# Altium schematic sheet Expansion & Miscelaneous.SchDoc
size A
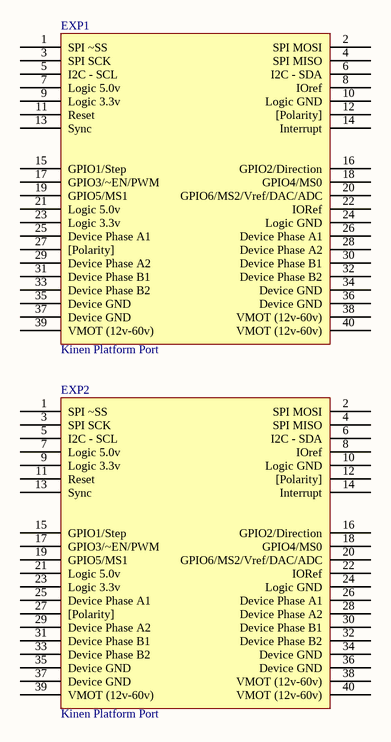
[diagram p0: Expansion & Miscelaneous.SchDoc]

## Parts
EXP1  Kinen Platform Port  [Kinen Port]
EXP2  Kinen Platform Port  [Kinen Port]

## Nets

Not connected (* = marked no-connect by the designer): EXP1 1(SPI_~SS) 2(SPI_MOSI) 3(SPI_SCK) 4(SPI_MISO) 5(I2C_-_SCL) 6(I2C_-_SDA) 7(Logic_5.0v) 8(IOref) 9(Logic_3.3v) 10(Logic_GND) 11(Reset) 12([Polarity]) 13(Sync) 14(Interrupt) 15(GPIO1/Step) 16(GPIO2/Direction) 17(GPIO3/~EN/PWM) 18(GPIO4/MS0) 19(GPIO5/MS1) 20(GPIO6/MS2/Vref/DAC/ADC) 21(Logic_5.0v) 22(IORef) 23(Logic_3.3v) 24(Logic_GND) 25(Device_Phase_A1) 26(Device_Phase_A1) 27([Polarity]) 28(Device_Phase_A2) 29(Device_Phase_A2) 30(Device_Phase_B1) 31(Device_Phase_B1) 32(Device_Phase_B2) 33(Device_Phase_B2) 34(Device_GND) 35(Device_GND) 36(Device_GND) 37(Device_GND) 38(VMOT_(12v-60v)) 39(VMOT_(12v-60v)) 40(VMOT_(12v-60v)); EXP2 1(SPI_~SS) 2(SPI_MOSI) 3(SPI_SCK) 4(SPI_MISO) 5(I2C_-_SCL) 6(I2C_-_SDA) 7(Logic_5.0v) 8(IOref) 9(Logic_3.3v) 10(Logic_GND) 11(Reset) 12([Polarity]) 13(Sync) 14(Interrupt) 15(GPIO1/Step) 16(GPIO2/Direction) 17(GPIO3/~EN/PWM) 18(GPIO4/MS0) 19(GPIO5/MS1) 20(GPIO6/MS2/Vref/DAC/ADC) 21(Logic_5.0v) 22(IORef) 23(Logic_3.3v) 24(Logic_GND) 25(Device_Phase_A1) 26(Device_Phase_A1) 27([Polarity]) 28(Device_Phase_A2) 29(Device_Phase_A2) 30(Device_Phase_B1) 31(Device_Phase_B1) 32(Device_Phase_B2) 33(Device_Phase_B2) 34(Device_GND) 35(Device_GND) 36(Device_GND) 37(Device_GND) 38(VMOT_(12v-60v)) 39(VMOT_(12v-60v)) 40(VMOT_(12v-60v))

## Library data of the parts
EXP1 EXP2 = Kinen Port